# EasyEDA Pro project ProPrj_四轴3.0_2025-12-06.epro, board 3V降压（4.5V-12V -> 5V）
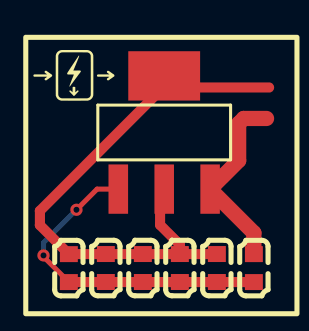
[diagram p8: board, top side]
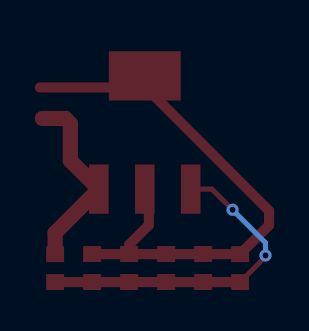
[diagram p9: board, bottom side, seen from below]

No outline. copper layers: Top Layer, Bottom Layer. Coordinates in mm from the lowest, leftmost part position.
Stack: Top Layer 0.035mm / Dielectric1 1.51mm FR4 er 4.5 / Bottom Layer 0.035mm

## Design rules (mm)
template: JLCPCB Capability(Two Layers Board)
spacing copperThickness1oz (default): track to track 0.102, other pairs 0.152 to 0.3
spacing copperThickness2oz: track to track 0.203, other pairs 0.152 to 0.3
track width copperThickness1oz (default): min 0.127, default 0.254, max 2.54
track width copperThickness2oz: min 0.203, default 0.254, max 2.54
differential pair differentialPair (default): width min 0.127, default 0.254, max 2.54; gap min 0.152, default 0.152
via viaSize (default): diameter min 0.5, default 0.61, max 10; hole min 0.3, default 0.305, max 6.3

## Placement (name value [footprint] x y rotation side)
C2  100nF  [C0603]  7.42 0 90 top
C3  100nF  [C0603]  5.56 0 90 top
C4  100nF  [C0603]  3.71 0 90 top
C5  100nF  [C0603]  1.85 0 90 top
C12  10uF  [C0603]  9.27 0 270 top
C13  10uF  [C0603]  0 0 270 top
U4  AMS1117-3.3V  [SOT-223-4_L6.5-W3.5-P2.30-LS7.0-TR]  4.78 6.79 0 top

## Footprints (pads in the part's own frame, mm; a bottom-side part is the same pattern mirrored in y, then rotated)
C0603
  rect 0.8x0.9 smd: 1(-0.7,0) 2(0.7,0)
SOT-223-4_L6.5-W3.5-P2.30-LS7.0-TR
  rect 0.98x2.47 smd: 1(-2.3,-2.835) 2(0,-2.835) 3(2.3,-2.835)
  rect 3.6x2.47 smd: 4(0,2.835)

## Nets
3V3: C2.2 C3.2 C4.2 C5.2 C13.1 U4.2 U4.4
GND: C2.1 C3.1 C4.1 C5.1 C12.2 C13.2 U4.1
VCC: C12.1 U4.3

## Via types
v1: diameter 0.61, hole 0.305, Top Layer to Bottom Layer, 2 vias

## Routing (per net, layer and track width the routed paths; a pad name or vN(x,y) marks a point on that pad's centre or on a via; arc(x,y) is an arc through that point)
3V3: length 28.8
  Top Layer w0.508: C3.2 5.56,1.17 4.57,2.16 4.57,3.75 U4.2 ; 10.03,9.04 5.36,9.04 U4.4 4.78,9.1 -1.45,2.87 -1.45,2.15 C13.1 7.41,0.7 C2.2
GND: length 16.6
  Top Layer w0.254: v1(0.38,2.92) 1.42,3.95 U4.1 ; C13.2 -1.27,0.57 v1(-1.27,0.63)
  Top Layer w0.508: C13.2 C12.2
  Bottom Layer w0.254: v1(-1.27,0.63) -1.27,1.27 v1(0.38,2.92)
VCC: length 9.5
  Top Layer w0.762: C12.1 9.27,1.76 U4.3 8.51,5.39 8.51,7.24 8.76,7.49 9.91,7.49
